# EAGLE design atmega8 (EAGLE 4.15)
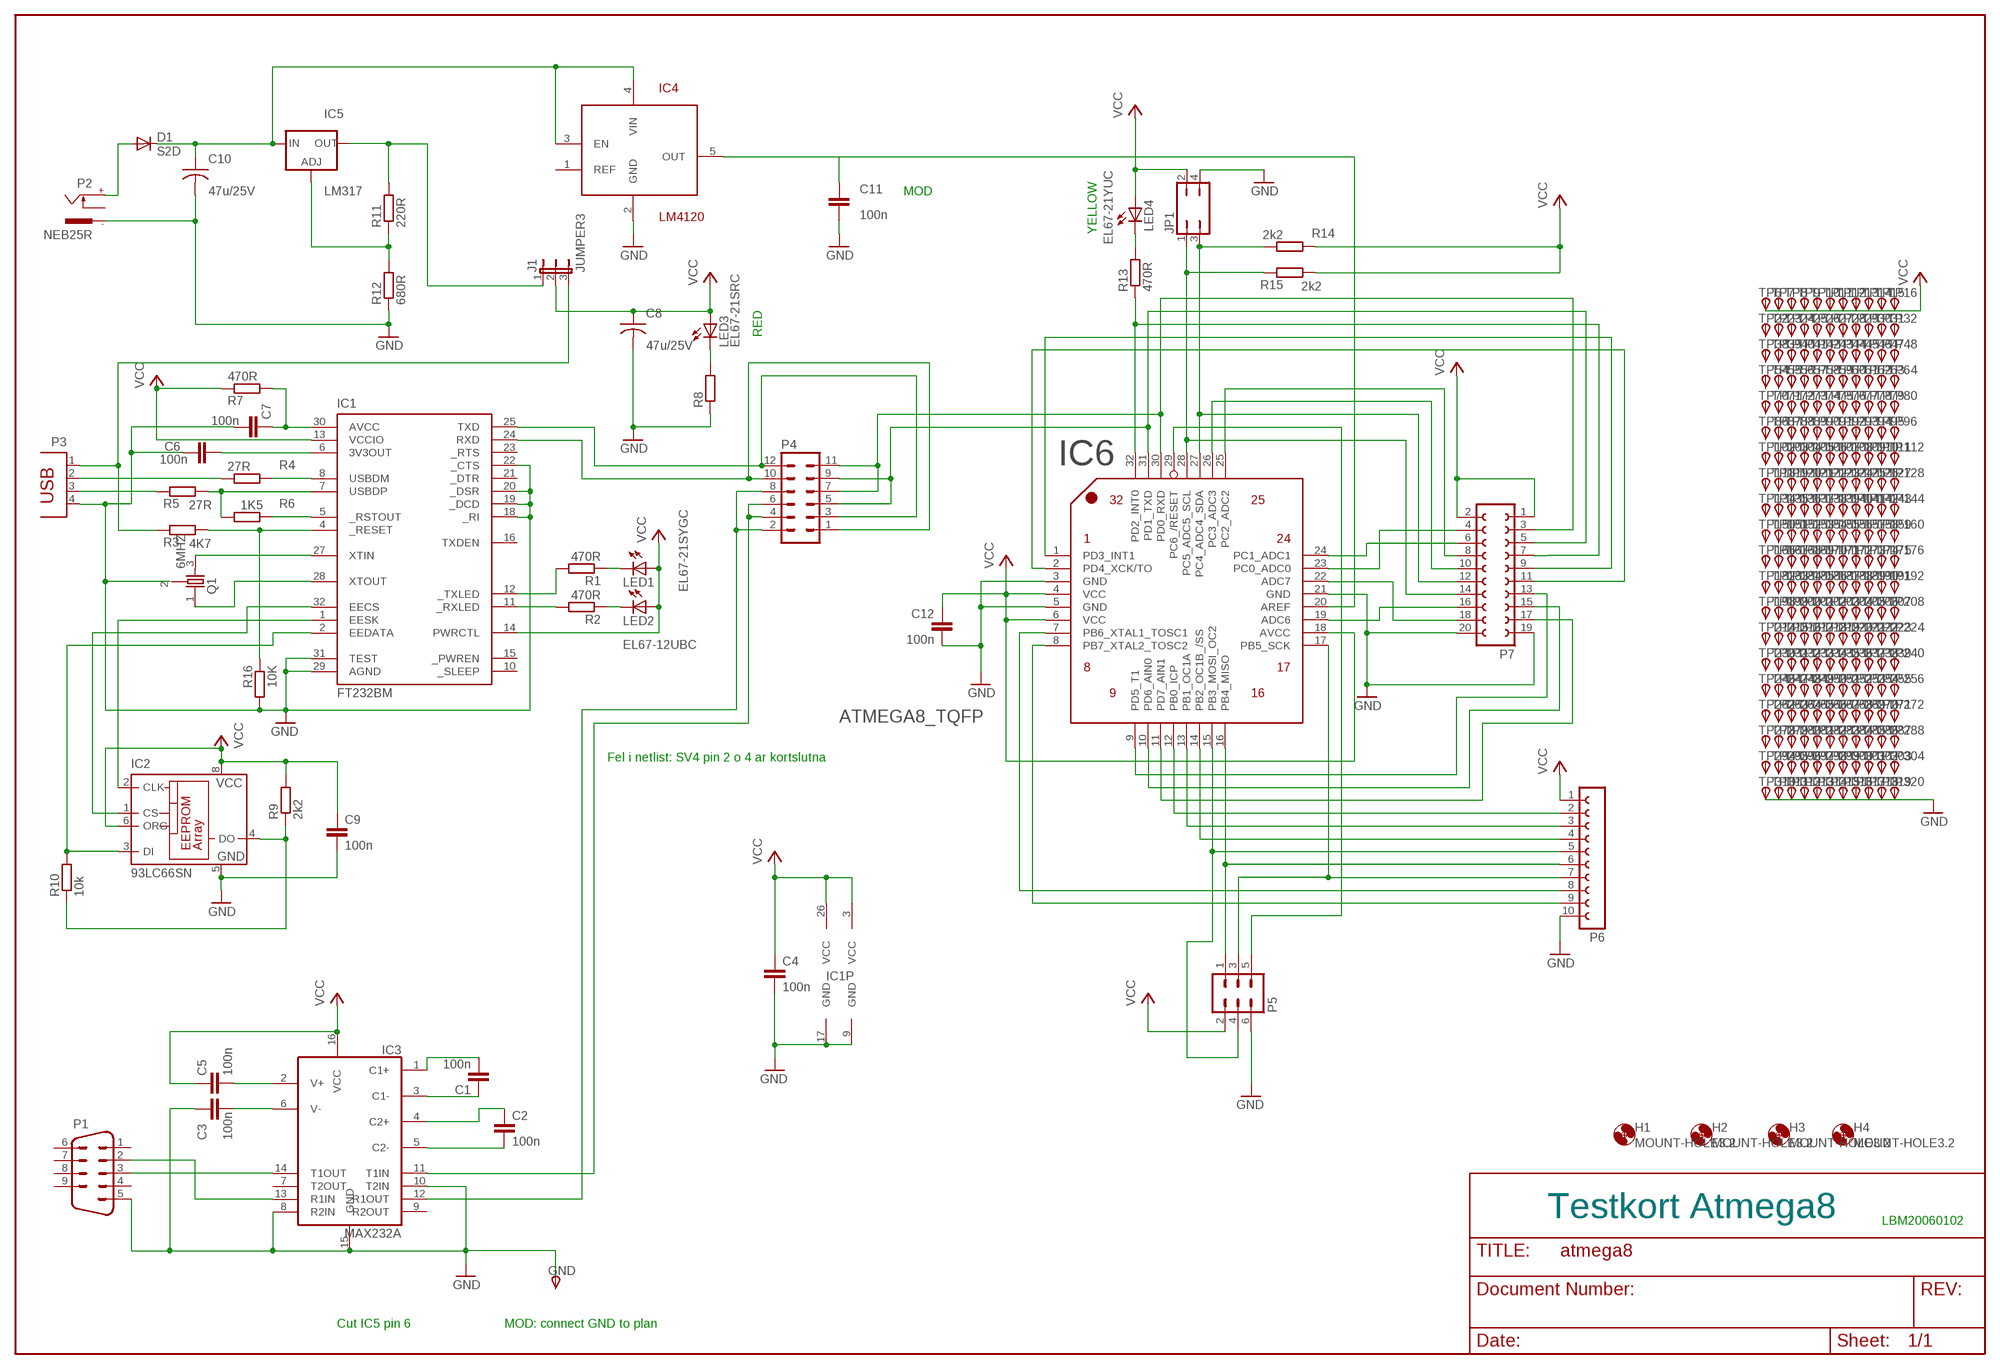
[diagram p0: schematic, sheet 1]

## Parts
C1  100n  C-EUC0805K  [C0805K]
C2  100n  C-EUC0805K  [C0805K]
C3  100n  C-EUC0805K  [C0805K]
C4  100n  C-EUC0805K  [C0805K]
C5  100n  C-EUC0805K  [C0805K]
C6  100n  C-EUC0805K  [C0805K]
C7  100n  C-EUC0805K  [C0805K]
C8  47u/25V  CAP2.5  [CAP2.5]
C9  100n  C-EUC0805K  [C0805K]
C10  47u/25V  CAP2.5  [CAP2.5]
C11  100n  C-EUC0805K  [C0805K]
C12  100n  C-EUC0805K  [C0805K]
D1  S2D  DIODE-SMB  [SMB]
GND  TPSPAD1-13  [P1-13]
H1  MOUNT-HOLE3.2  [3,2]
H2  MOUNT-HOLE3.2  [3,2]
H3  MOUNT-HOLE3.2  [3,2]
H4  MOUNT-HOLE3.2  [3,2]
IC1  FT232BM  [LQFP32]
IC2  93LC66SN  [SO-08]
IC3  MAX232A  [SO16]
IC4  LM4120  [SOT23-5]
IC5  LM317  LM317TS  [317TS]
IC6  ATMEGA8_TQFP  [TQFP-32]
J1  JUMPER3  [JUMPER3]
JP1  JP2Q  [JP2Q]
LED1  EL67-21SYGC  LEDSMT1206  [1206]
LED2  EL67-12UBC  LEDSMT1206  [1206]
LED3  EL67-21SRC  LEDSMT1206  [1206]
LED4  EL67-21YUC  LEDSMT1206  [1206]
P1  M09H  [M09H]
P2  NEB25R  [NEB25R]
P3  PN61729  [PN61729]
P4  MA06-2  [MA06-2]
P5  MA03-2  [MA03-2]
P6  FE10-1  [FE10]
P7  FE10-2  [FE10-2]
Q1  6MHZ  MURATA_RESONATOR  [MURATA_RESONATOR]
R1  470R  R-EU_R0805W  [R0805W]
R2  470R  R-EU_R0805W  [R0805W]
R3  4K7  R-EU_R0805W  [R0805W]
R4  27R  R-EU_R0805W  [R0805W]
R5  27R  R-EU_R0805W  [R0805W]
R6  1K5  R-EU_R0805W  [R0805W]
R7  470R  R-EU_R0805W  [R0805W]
R8  R-EU_R0805W  [R0805W]
R9  2k2  R-EU_R0805W  [R0805W]
R10  10k  R-EU_R0805W  [R0805W]
R11  220R  R-EU_R0805W  [R0805W]
R12  680R  R-EU_R0805W  [R0805W]
R13  470R  R-EU_R0805W  [R0805W]
R14  2k2  R-EU_R0805W  [R0805W]
R15  2k2  R-EU_R0805W  [R0805W]
R16  10K  R-EU_R0805W  [R0805W]
TP6  TPSPAD1-13  [P1-13]
TP7  TPSPAD1-13  [P1-13]
TP8  TPSPAD1-13  [P1-13]
TP9  TPSPAD1-13  [P1-13]
TP10  TPSPAD1-13  [P1-13]
TP11  TPSPAD1-13  [P1-13]
TP12  TPSPAD1-13  [P1-13]
TP13  TPSPAD1-13  [P1-13]
TP14  TPSPAD1-13  [P1-13]
TP15  TPSPAD1-13  [P1-13]
TP16  TPSPAD1-13  [P1-13]
TP22  TPSPAD1-13  [P1-13]
TP23  TPSPAD1-13  [P1-13]
TP24  TPSPAD1-13  [P1-13]
TP25  TPSPAD1-13  [P1-13]
TP26  TPSPAD1-13  [P1-13]
TP27  TPSPAD1-13  [P1-13]
TP28  TPSPAD1-13  [P1-13]
TP29  TPSPAD1-13  [P1-13]
TP30  TPSPAD1-13  [P1-13]
TP31  TPSPAD1-13  [P1-13]
TP32  TPSPAD1-13  [P1-13]
TP38  TPSPAD1-13  [P1-13]
TP39  TPSPAD1-13  [P1-13]
TP40  TPSPAD1-13  [P1-13]
TP41  TPSPAD1-13  [P1-13]
TP42  TPSPAD1-13  [P1-13]
TP43  TPSPAD1-13  [P1-13]
TP44  TPSPAD1-13  [P1-13]
TP45  TPSPAD1-13  [P1-13]
TP46  TPSPAD1-13  [P1-13]
TP47  TPSPAD1-13  [P1-13]
TP48  TPSPAD1-13  [P1-13]
TP54  TPSPAD1-13  [P1-13]
TP55  TPSPAD1-13  [P1-13]
TP56  TPSPAD1-13  [P1-13]
TP57  TPSPAD1-13  [P1-13]
TP58  TPSPAD1-13  [P1-13]
TP59  TPSPAD1-13  [P1-13]
TP60  TPSPAD1-13  [P1-13]
TP61  TPSPAD1-13  [P1-13]
TP62  TPSPAD1-13  [P1-13]
TP63  TPSPAD1-13  [P1-13]
TP64  TPSPAD1-13  [P1-13]
TP70  TPSPAD1-13  [P1-13]
TP71  TPSPAD1-13  [P1-13]
TP72  TPSPAD1-13  [P1-13]
TP73  TPSPAD1-13  [P1-13]
TP74  TPSPAD1-13  [P1-13]
TP75  TPSPAD1-13  [P1-13]
TP76  TPSPAD1-13  [P1-13]
TP77  TPSPAD1-13  [P1-13]
TP78  TPSPAD1-13  [P1-13]
TP79  TPSPAD1-13  [P1-13]
TP80  TPSPAD1-13  [P1-13]
TP86  TPSPAD1-13  [P1-13]
TP87  TPSPAD1-13  [P1-13]
TP88  TPSPAD1-13  [P1-13]
TP89  TPSPAD1-13  [P1-13]
TP90  TPSPAD1-13  [P1-13]
TP91  TPSPAD1-13  [P1-13]
TP92  TPSPAD1-13  [P1-13]
TP93  TPSPAD1-13  [P1-13]
TP94  TPSPAD1-13  [P1-13]
TP95  TPSPAD1-13  [P1-13]
TP96  TPSPAD1-13  [P1-13]
TP102  TPSPAD1-13  [P1-13]
TP103  TPSPAD1-13  [P1-13]
TP104  TPSPAD1-13  [P1-13]
TP105  TPSPAD1-13  [P1-13]
TP106  TPSPAD1-13  [P1-13]
TP107  TPSPAD1-13  [P1-13]
TP108  TPSPAD1-13  [P1-13]
TP109  TPSPAD1-13  [P1-13]
TP110  TPSPAD1-13  [P1-13]
TP111  TPSPAD1-13  [P1-13]
TP112  TPSPAD1-13  [P1-13]
TP118  TPSPAD1-13  [P1-13]
TP119  TPSPAD1-13  [P1-13]
TP120  TPSPAD1-13  [P1-13]
TP121  TPSPAD1-13  [P1-13]
TP122  TPSPAD1-13  [P1-13]
TP123  TPSPAD1-13  [P1-13]
TP124  TPSPAD1-13  [P1-13]
TP125  TPSPAD1-13  [P1-13]
TP126  TPSPAD1-13  [P1-13]
TP127  TPSPAD1-13  [P1-13]
TP128  TPSPAD1-13  [P1-13]
TP134  TPSPAD1-13  [P1-13]
TP135  TPSPAD1-13  [P1-13]
TP136  TPSPAD1-13  [P1-13]
TP137  TPSPAD1-13  [P1-13]
TP138  TPSPAD1-13  [P1-13]
TP139  TPSPAD1-13  [P1-13]
TP140  TPSPAD1-13  [P1-13]
TP141  TPSPAD1-13  [P1-13]
TP142  TPSPAD1-13  [P1-13]
TP143  TPSPAD1-13  [P1-13]
TP144  TPSPAD1-13  [P1-13]
TP150  TPSPAD1-13  [P1-13]
TP151  TPSPAD1-13  [P1-13]
TP152  TPSPAD1-13  [P1-13]
TP153  TPSPAD1-13  [P1-13]
TP154  TPSPAD1-13  [P1-13]
TP155  TPSPAD1-13  [P1-13]
TP156  TPSPAD1-13  [P1-13]
TP157  TPSPAD1-13  [P1-13]
TP158  TPSPAD1-13  [P1-13]
TP159  TPSPAD1-13  [P1-13]
TP160  TPSPAD1-13  [P1-13]
TP166  TPSPAD1-13  [P1-13]
TP167  TPSPAD1-13  [P1-13]
TP168  TPSPAD1-13  [P1-13]
TP169  TPSPAD1-13  [P1-13]
TP170  TPSPAD1-13  [P1-13]
TP171  TPSPAD1-13  [P1-13]
TP172  TPSPAD1-13  [P1-13]
TP173  TPSPAD1-13  [P1-13]
TP174  TPSPAD1-13  [P1-13]
TP175  TPSPAD1-13  [P1-13]
TP176  TPSPAD1-13  [P1-13]
TP182  TPSPAD1-13  [P1-13]
TP183  TPSPAD1-13  [P1-13]
TP184  TPSPAD1-13  [P1-13]
TP185  TPSPAD1-13  [P1-13]
TP186  TPSPAD1-13  [P1-13]
TP187  TPSPAD1-13  [P1-13]
TP188  TPSPAD1-13  [P1-13]
TP189  TPSPAD1-13  [P1-13]
TP190  TPSPAD1-13  [P1-13]
TP191  TPSPAD1-13  [P1-13]
TP192  TPSPAD1-13  [P1-13]
TP198  TPSPAD1-13  [P1-13]
TP199  TPSPAD1-13  [P1-13]
TP200  TPSPAD1-13  [P1-13]
TP201  TPSPAD1-13  [P1-13]
TP202  TPSPAD1-13  [P1-13]
TP203  TPSPAD1-13  [P1-13]
TP204  TPSPAD1-13  [P1-13]
TP205  TPSPAD1-13  [P1-13]
TP206  TPSPAD1-13  [P1-13]
TP207  TPSPAD1-13  [P1-13]
TP208  TPSPAD1-13  [P1-13]
TP214  TPSPAD1-13  [P1-13]
TP215  TPSPAD1-13  [P1-13]
TP216  TPSPAD1-13  [P1-13]
TP217  TPSPAD1-13  [P1-13]
TP218  TPSPAD1-13  [P1-13]
TP219  TPSPAD1-13  [P1-13]
TP220  TPSPAD1-13  [P1-13]
TP221  TPSPAD1-13  [P1-13]
TP222  TPSPAD1-13  [P1-13]
TP223  TPSPAD1-13  [P1-13]
TP224  TPSPAD1-13  [P1-13]
TP230  TPSPAD1-13  [P1-13]
TP231  TPSPAD1-13  [P1-13]
TP232  TPSPAD1-13  [P1-13]
TP233  TPSPAD1-13  [P1-13]
TP234  TPSPAD1-13  [P1-13]
TP235  TPSPAD1-13  [P1-13]
TP236  TPSPAD1-13  [P1-13]
TP237  TPSPAD1-13  [P1-13]
TP238  TPSPAD1-13  [P1-13]
TP239  TPSPAD1-13  [P1-13]
TP240  TPSPAD1-13  [P1-13]
TP246  TPSPAD1-13  [P1-13]
TP247  TPSPAD1-13  [P1-13]
TP248  TPSPAD1-13  [P1-13]
TP249  TPSPAD1-13  [P1-13]
TP250  TPSPAD1-13  [P1-13]
TP251  TPSPAD1-13  [P1-13]
TP252  TPSPAD1-13  [P1-13]
TP253  TPSPAD1-13  [P1-13]
TP254  TPSPAD1-13  [P1-13]
TP255  TPSPAD1-13  [P1-13]
TP256  TPSPAD1-13  [P1-13]
TP262  TPSPAD1-13  [P1-13]
TP263  TPSPAD1-13  [P1-13]
TP264  TPSPAD1-13  [P1-13]
TP265  TPSPAD1-13  [P1-13]
TP266  TPSPAD1-13  [P1-13]
TP267  TPSPAD1-13  [P1-13]
TP268  TPSPAD1-13  [P1-13]
TP269  TPSPAD1-13  [P1-13]
TP270  TPSPAD1-13  [P1-13]
TP271  TPSPAD1-13  [P1-13]
TP272  TPSPAD1-13  [P1-13]
TP278  TPSPAD1-13  [P1-13]
TP279  TPSPAD1-13  [P1-13]
TP280  TPSPAD1-13  [P1-13]
TP281  TPSPAD1-13  [P1-13]
TP282  TPSPAD1-13  [P1-13]
TP283  TPSPAD1-13  [P1-13]
TP284  TPSPAD1-13  [P1-13]
TP285  TPSPAD1-13  [P1-13]
TP286  TPSPAD1-13  [P1-13]
TP287  TPSPAD1-13  [P1-13]
TP288  TPSPAD1-13  [P1-13]
TP294  TPSPAD1-13  [P1-13]
TP295  TPSPAD1-13  [P1-13]
TP296  TPSPAD1-13  [P1-13]
TP297  TPSPAD1-13  [P1-13]
TP298  TPSPAD1-13  [P1-13]
TP299  TPSPAD1-13  [P1-13]
TP300  TPSPAD1-13  [P1-13]
TP301  TPSPAD1-13  [P1-13]
TP302  TPSPAD1-13  [P1-13]
TP303  TPSPAD1-13  [P1-13]
TP304  TPSPAD1-13  [P1-13]
TP310  TPSPAD1-13  [P1-13]
TP311  TPSPAD1-13  [P1-13]
TP312  TPSPAD1-13  [P1-13]
TP313  TPSPAD1-13  [P1-13]
TP314  TPSPAD1-13  [P1-13]
TP315  TPSPAD1-13  [P1-13]
TP316  TPSPAD1-13  [P1-13]
TP317  TPSPAD1-13  [P1-13]
TP318  TPSPAD1-13  [P1-13]
TP319  TPSPAD1-13  [P1-13]
TP320  TPSPAD1-13  [P1-13]

## Nets
GND [power]: C3.1 C4.2 C6.2 C7.2 C8.2 C9.2 C10.2 C11.2 C12.2 IC1.9(GND) IC1.17(GND) IC1.18(_RI) IC1.19(_DCD) IC1.20(_DSR) IC1.22(_CTS) IC1.29(AGND) IC1.31(TEST) IC2.5(GND) IC3.8(R2IN) IC3.10(T2IN) IC3.15(GND) IC4.2(GND) IC6.3(GND) IC6.5(GND) IC6.21(GND) JP1.4 P1.5 P2.- P3.4 P5.6 P6.10 P7.19 P7.20 Q1.2 R8.1 R12.1 R16.2 TP310.1(PP) TP311.1(PP) TP312.1(PP) TP313.1(PP) TP314.1(PP) TP315.1(PP) TP316.1(PP) TP317.1(PP) TP318.1(PP) TP319.1(PP) TP320.1(PP)
N$1 [power]: IC5.2(OUT) J1.1 R11.2
N$2 [power]: C10.1 D1.C IC4.3(EN) IC4.4(VIN) IC5.3(IN)
N$3 [power]: D1.A P2.+
N$4: IC5.1(ADJ) R11.1 R12.2
N$5: IC1.8(USBDM) R4.2
N$6: IC1.27(XTIN) Q1.3
N$7: P3.2 R4.1
N$8: P3.3 R5.1
N$9: IC1.7(USBDP) R5.2 R6.1
N$10: IC1.28(XTOUT) Q1.1
N$11 [power]: J1.3 P3.1 R3.1
N$12: IC1.4(_RESET) R3.2 R16.1
N$13: IC1.5(_RSTOUT) R6.2
N$14: LED3.C R8.2
N$15: C5.2 IC3.2(V+)
N$16: C7.1 IC1.30(AVCC) R7.2
N$17: C6.1 IC1.6(3V3OUT)
N$18: C3.2 IC3.6(V-)
N$19: IC6.16(PB4_MISO) P5.1 P6.6
N$20: C1.1 IC3.3(C1-)
N$21: C1.2 IC3.1(C1+)
N$22: C2.1 IC3.4(C2+)
N$23: C2.2 IC3.5(C2-)
N$24: IC6.15(PB3_MOSI_OC2) P5.4 P6.5
N$25: IC6.17(PB5_SCK) P5.3 P6.7
N$26: IC6.29(PC6_/RESET) P5.5
N$27: IC6.30(PD0_RXD) P4.7 P4.11 P7.3
N$28: IC6.31(PD1_TXD) P4.5 P4.9 P7.5
N$29: IC6.32(PD2_INT0) P7.7 R13.1
N$30: IC6.1(PD3_INT1) P7.9
N$31: IC6.2(PD4_XCK/TO) P7.11
N$32: IC6.28(PC5_ADC5_SCL) JP1.1 P7.14 R15.2
N$33: IC6.27(PC4_ADC4_SDA) JP1.3 P7.12 R14.2
N$34: IC6.26(PC3_ADC3) P7.10
N$35: IC6.25(PC2_ADC2) P7.8
N$36: IC6.24(PC1_ADC1) P7.6
N$37: IC6.23(PC0_ADC0) P7.4
N$38: IC6.22(ADC7) P7.18
N$39: IC6.19(ADC6) P7.16
N$40: IC2.4(DO) R9.1 R10.1
N$41: IC6.14(PB2_OC1B_/SS) P6.4
N$42: IC6.13(PB1_OC1A) P6.3
N$43: IC6.12(PB0_ICP) P6.2
N$44: IC6.11(PD7_AIN1) P7.17
N$45: IC6.10(PD6_AIN0) P7.15
N$46: IC6.9(PD5_T1) P7.13
N$47: IC6.7(PB6_XTAL1_TOSC1) P6.8
N$48: IC6.8(PB7_XTAL2_TOSC2) P6.9
N$49: C11.1 IC4.5(OUT) IC6.20(AREF)
N$50: LED4.C R13.2
N$51: IC1.25(TXD) P4.3 P4.12
N$52: IC1.24(RXD) P4.1 P4.10
N$53: LED1.C R1.1
N$54: LED2.C R2.1
N$55: IC1.11(_RXLED) R2.2
N$56: IC1.12(_TXLED) R1.2
N$57: IC1.1(EESK) IC2.2(CLK)
N$58: IC1.32(EECS) IC2.1(CS)
N$59: IC1.2(EEDATA) IC2.3(DI) R10.2
N$60: IC3.14(T1OUT) P1.3
N$61: IC3.13(R1IN) P1.2
N$62: IC3.11(T1IN) IC3.12(R1OUT) P4.2 P4.4 P4.6 P4.8
VCC [power]: C4.1 C5.1 C8.1 C9.1 C12.1 IC1.3(VCC) IC1.13(VCCIO) IC1.14(PWRCTL) IC1.26(VCC) IC2.6(ORG) IC2.8(VCC) IC3.16(VCC) IC6.4(VCC) IC6.6(VCC) IC6.18(AVCC) J1.2 JP1.2 LED1.A LED2.A LED3.A LED4.A P5.2 P6.1 P7.1 P7.2 R7.1 R9.2 R14.1 R15.1 TP6.1(PP) TP7.1(PP) TP8.1(PP) TP9.1(PP) TP10.1(PP) TP11.1(PP) TP12.1(PP) TP13.1(PP) TP14.1(PP) TP15.1(PP) TP16.1(PP)
Unconnected: GND.1(PP) IC1.10(_SLEEP) IC1.15(_PWREN) IC1.16(TXDEN) IC1.21(_DTR) IC1.23(_RTS) IC2.7(NU) IC3.7(T2OUT) IC3.9(R2OUT) IC4.1(REF) P1.1 P1.4 P1.6 P1.7 P1.8 P1.9 P2.C TP22.1(PP) TP23.1(PP) TP24.1(PP) TP25.1(PP) TP26.1(PP) TP27.1(PP) TP28.1(PP) TP29.1(PP) TP30.1(PP) TP31.1(PP) TP32.1(PP) TP38.1(PP) TP39.1(PP) TP40.1(PP) TP41.1(PP) TP42.1(PP) TP43.1(PP) TP44.1(PP) TP45.1(PP) TP46.1(PP) TP47.1(PP) TP48.1(PP) TP54.1(PP) TP55.1(PP) TP56.1(PP) TP57.1(PP) TP58.1(PP) TP59.1(PP) TP60.1(PP) TP61.1(PP) TP62.1(PP) TP63.1(PP) TP64.1(PP) TP70.1(PP) TP71.1(PP) TP72.1(PP) TP73.1(PP) TP74.1(PP) TP75.1(PP) TP76.1(PP) TP77.1(PP) TP78.1(PP) TP79.1(PP) TP80.1(PP) TP86.1(PP) TP87.1(PP) TP88.1(PP) TP89.1(PP) TP90.1(PP) TP91.1(PP) TP92.1(PP) TP93.1(PP) TP94.1(PP) TP95.1(PP) TP96.1(PP) TP102.1(PP) TP103.1(PP) TP104.1(PP) TP105.1(PP) TP106.1(PP) TP107.1(PP) TP108.1(PP) TP109.1(PP) TP110.1(PP) TP111.1(PP) TP112.1(PP) TP118.1(PP) TP119.1(PP) TP120.1(PP) TP121.1(PP) TP122.1(PP) TP123.1(PP) TP124.1(PP) TP125.1(PP) TP126.1(PP) TP127.1(PP) TP128.1(PP) TP134.1(PP) TP135.1(PP) TP136.1(PP) TP137.1(PP) TP138.1(PP) TP139.1(PP) TP140.1(PP) TP141.1(PP) TP142.1(PP) TP143.1(PP) TP144.1(PP) TP150.1(PP) TP151.1(PP) TP152.1(PP) TP153.1(PP) TP154.1(PP) TP155.1(PP) TP156.1(PP) TP157.1(PP) TP158.1(PP) TP159.1(PP) TP160.1(PP) TP166.1(PP) TP167.1(PP) TP168.1(PP) TP169.1(PP) TP170.1(PP) TP171.1(PP) TP172.1(PP) TP173.1(PP) TP174.1(PP) TP175.1(PP) TP176.1(PP) TP182.1(PP) TP183.1(PP) TP184.1(PP) TP185.1(PP) TP186.1(PP) TP187.1(PP) TP188.1(PP) TP189.1(PP) TP190.1(PP) TP191.1(PP) TP192.1(PP) TP198.1(PP) TP199.1(PP) TP200.1(PP) TP201.1(PP) TP202.1(PP) TP203.1(PP) TP204.1(PP) TP205.1(PP) TP206.1(PP) TP207.1(PP) TP208.1(PP) TP214.1(PP) TP215.1(PP) TP216.1(PP) TP217.1(PP) TP218.1(PP) TP219.1(PP) TP220.1(PP) TP221.1(PP) TP222.1(PP) TP223.1(PP) TP224.1(PP) TP230.1(PP) TP231.1(PP) TP232.1(PP) TP233.1(PP) TP234.1(PP) TP235.1(PP) TP236.1(PP) TP237.1(PP) TP238.1(PP) TP239.1(PP) TP240.1(PP) TP246.1(PP) TP247.1(PP) TP248.1(PP) TP249.1(PP) TP250.1(PP) TP251.1(PP) TP252.1(PP) TP253.1(PP) TP254.1(PP) TP255.1(PP) TP256.1(PP) TP262.1(PP) TP263.1(PP) TP264.1(PP) TP265.1(PP) TP266.1(PP) TP267.1(PP) TP268.1(PP) TP269.1(PP) TP270.1(PP) TP271.1(PP) TP272.1(PP) TP278.1(PP) TP279.1(PP) TP280.1(PP) TP281.1(PP) TP282.1(PP) TP283.1(PP) TP284.1(PP) TP285.1(PP) TP286.1(PP) TP287.1(PP) TP288.1(PP) TP294.1(PP) TP295.1(PP) TP296.1(PP) TP297.1(PP) TP298.1(PP) TP299.1(PP) TP300.1(PP) TP301.1(PP) TP302.1(PP) TP303.1(PP) TP304.1(PP)

## Notes on the sheet
- MOD
- YELLOW
- RED
- Fel i netlist: SV4 pin 2 o 4 ar kortslutna
- Testkort Atmega8
- LBM20060102
- Cut IC5 pin 6 | MOD: connect GND to plan

## Library data of the parts
C1-C7 C9 C11 C12 = rcl:C-EU: CAPACITOR, European symbol
C8 C10 = lbm:CAP2.5
D1 = diode:DIODE-: DIODE
GND TP6-TP16 TP22-TP32 TP38-TP48 TP54-TP64 TP70-TP80 TP86-TP96 TP102-TP112 TP118-TP128 TP134-TP144 TP150-TP160 TP166-TP176 TP182-TP192 TP198-TP208 TP214-TP224 TP230-TP240 TP246-TP256 TP262-TP272 TP278-TP288 TP294-TP304 TP310-TP320 = testpad:TPS: TEST PIN
H1-H4 = holes:MOUNT-HOLE: MOUNTING HOLE with drill center marker
IC1 = ftdi3:FT232BM: USB UART 2nd Generation USB UART (USB <-> Serial)
IC2 = microchip:93*: Serial EPROM 1 K/2 K/4 K, low voltage, Microwire
IC3 = lbm:MAX232A
IC4 = lbm:LM4120
IC5 = v-reg:LM317TS: VOLTAGE REGULATOR
IC6 = atmel_prototype_header:ATMEGA8: IC AVR MCU 8K LV 8MHZ IND 32TQFP , Atmel Part number ATMEGA8L-8AI
J1 = lbm:JUMPER3
JP1 = jumper:JP2Q: JUMPER
LED1-LED4 = led:LED: LED OSRAM: - CHIPLED LG R971, LG N971, LY N971, LG Q971, LY Q971, LO R971, LY R971 LH N974, LH R974 LS Q976, LO Q976, LY Q976 LO Q996 - Hyper CHIPLED LW Q18S LB Q993, LB Q99A, LB R99A - SideLED LS A670, LO A670, LY A670, LG A670, LP A670 LB A673, LV A673, LT A673, LW A673 LH A674 LY A675 LS A676, LA A676, LO A676, LY A676, LW A676 LS A679, LY A679, LG A679 - Hyper Micro SIDELED® LS Y876, LA Y876, LO Y876, LY Y876 LT Y87S - SmartLED LW L88C, LW L88S LB L89C, LB L89S, LG L890 LS L89K, LO L89K, LY L89K LS L896, LA L896, LO L896, LY L896 - TOPLED LS T670, LO T670, LY T670, LG T670, LP T670 LSG T670, LSP T670, LSY T670, LOP T670, LYG T670 LG T671, LOG T671, LSG T671 LB T673, LV T673, LT T673, LW T673 LH T674 LS T676, LA T676, LO T676, LY T676, LB T676, LH T676, LSB T676, LW T676 LB T67C, LV T67C, LT T67C, LS T67K, LO T67K, LY T67K, LW E67C LS E67B, LA E67B, LO E67B, LY E67B, LB E67C, LV E67C, LT E67C LW T67C LS T679, LY T679, LG T679 LS T770, LO T770, LY T770, LG T770, LP T770 LB T773, LV T773, LT T773, LW T773 LH T774 LS E675, LA E675, LY E675, LS T675 LS T776, LA T776, LO T776, LY T776, LB T776 LHGB T686 LT T68C, LB T68C - Hyper Mini TOPLED® LB M676 - Mini TOPLED Santana® LG M470 LS M47K, LO M47K, LY M47K Source: http://www.osram.convergy.de/
P1 = con-subd:M09: SUB-D
P2 = con-lumberg:NEB25R: Klinkeneinbaukupplung
P3 = con-berg:PN61729: BERG USB connector
P4 = con-lstb:MA06-2: PIN HEADER
P5 = con-lstb:MA03-2: PIN HEADER
P6 = con-lsta:FE10-1: FEMALE HEADER
P7 = con-lsta:FE10-2: FEMALE HEADER
Q1 = lbm:MURATA_RESONATOR
R1-R16 = rcl:R-EU_: RESISTOR, European symbol

## Net classes
1 power: width 0.813 mm, drill 0.203 mm

## Board
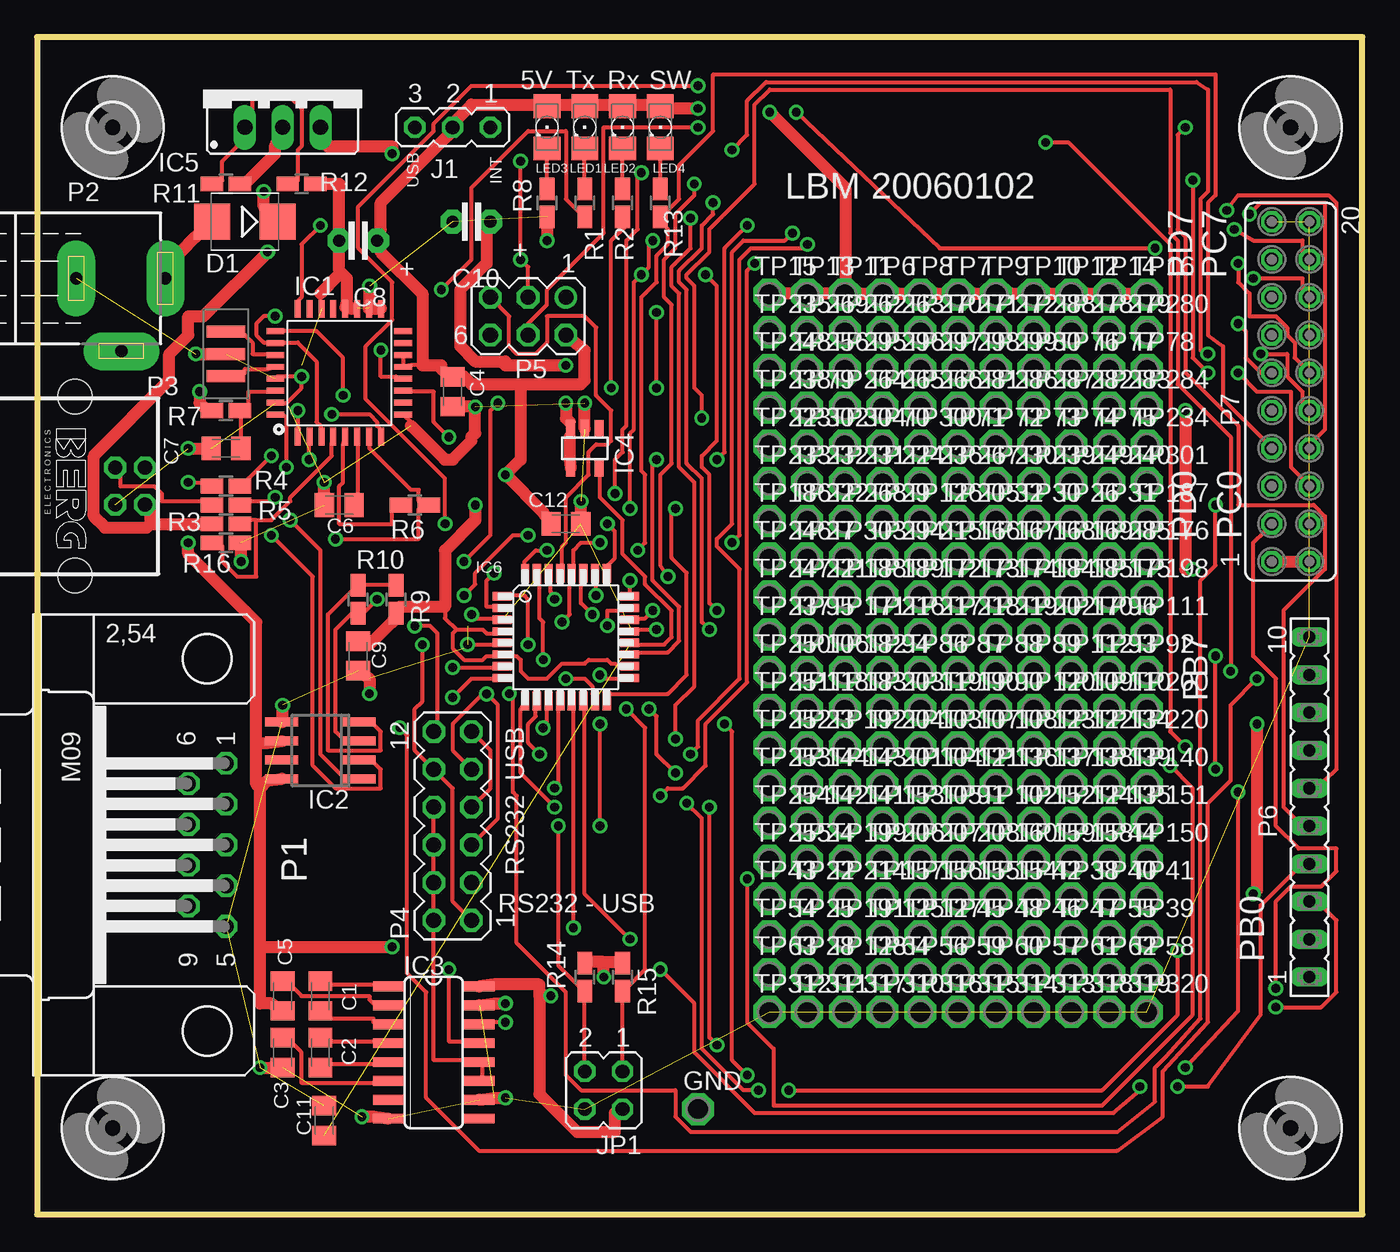
[diagram p1: board, top side]
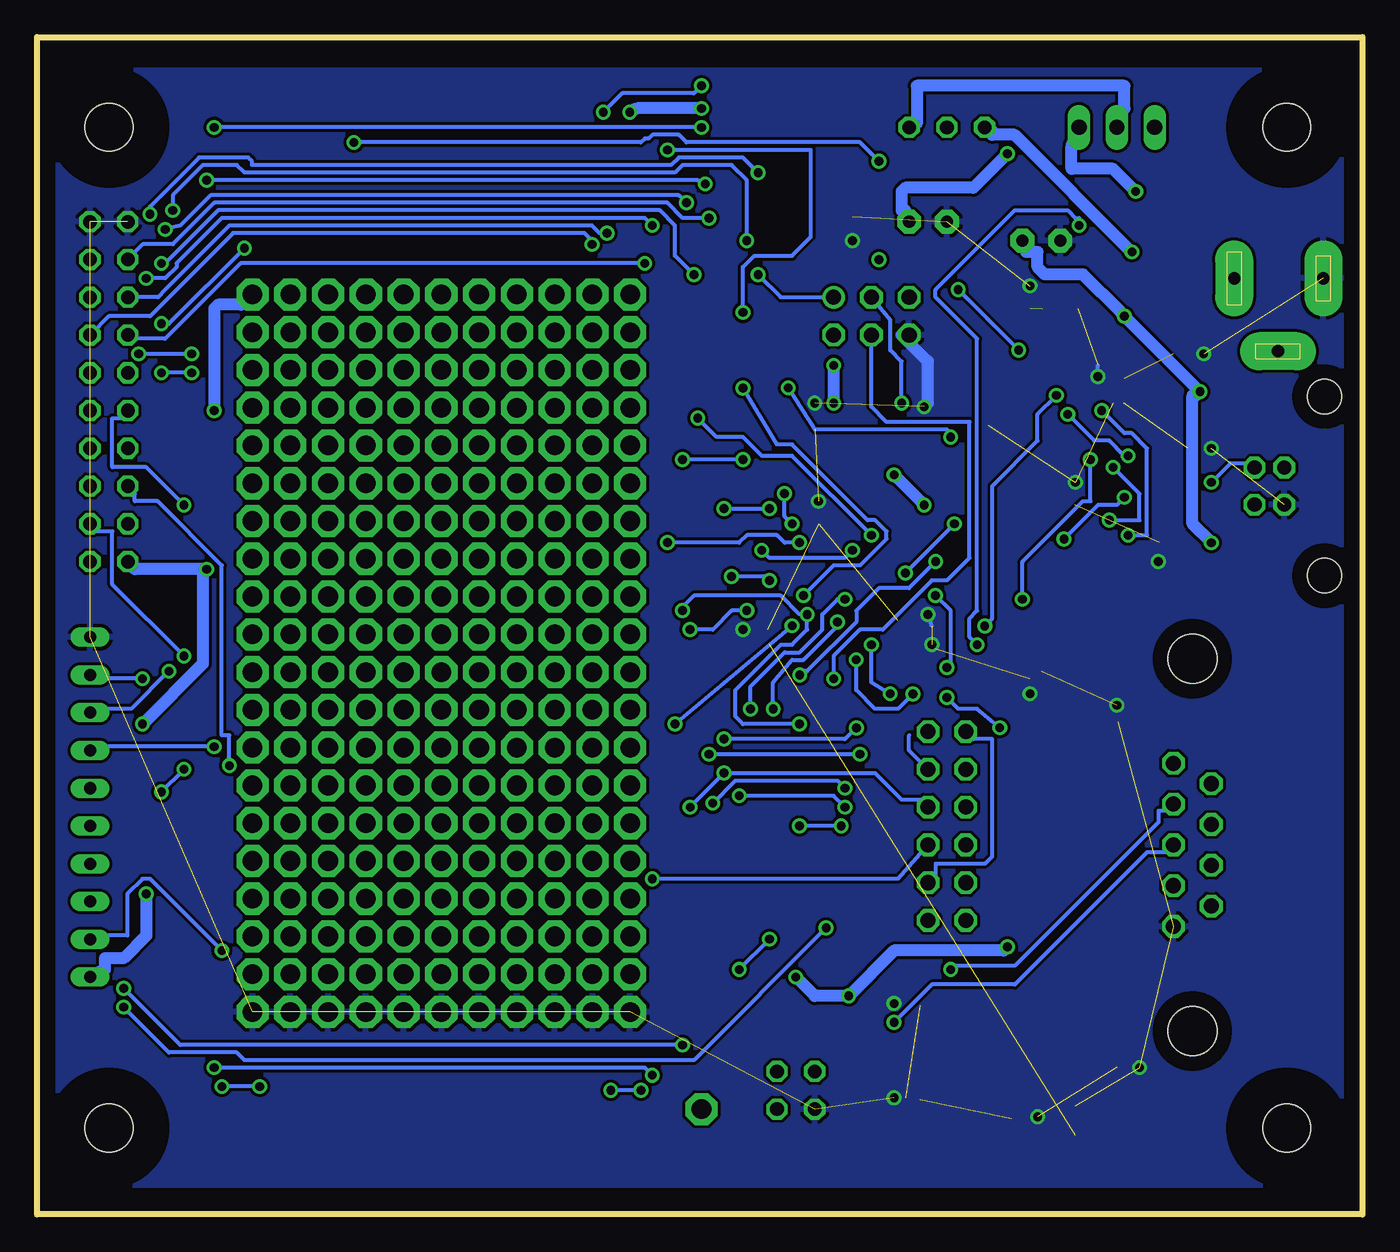
[diagram p2: board, bottom side, seen from below]

Size 89.13 x 79.18 mm. Coordinates in mm from the lower left corner, seen from the top.
Outline: 0,0 89.13,0 89.13,79.18 0,79.18 0,0
Copper layers (1*16): Top 0.035mm / dielectric 1.5mm / Bottom 0.035mm
Design rules "default": minimum track width 10mil, minimum drill 23mil, track to track 8mil, track to pad 8mil, pad to pad 8mil, via to via 8mil, smd to smd 8mil, copper to edge 40mil, drill to drill 8mil, minimum pad ring 10mil, minimum via ring 8mil, stop-mask expansion 4mil, vias tented up to drill 0mil, thermal gap 10mil
tKeepout: area 0,76.9 to 88.9,79.5; area 0,-0.5 to 88.9,2
bKeepout: area 0,76.9 to 88.9,79.5; area 0,-0.5 to 88.9,2

### Footprints (pad centres in the part's own frame; a part is rotated, then mirrored left to right if it is on the bottom)
C0805K = smd 1.3 x 1.6: 1 -1,0; 2 1,0
CAP2.5 = drill 0.813 pad 1.6 octagon: 1 -2.54,0; 2 0,0
SMB = smd 2.4 x 2.4: A 2.2,0; C -2.2,0
P1-13 = drill 1.321 pad 2.159 octagon: 1 0,0
3,2 = hole 3.2: 0,0
LQFP32 = smd 0.4 x 1.2: 1 -2.8,-4.3; 2 -2,-4.3; 3 -1.2,-4.3; 4 -0.4,-4.3; 5 0.4,-4.3; 6 1.2,-4.3; 7 2,-4.3; 8 2.8,-4.3; 17 2.8,4.3; 18 2,4.3; 19 1.2,4.3; 20 0.4,4.3; 21 -0.4,4.3; 22 -1.2,4.3; 23 -2,4.3; 24 -2.8,4.3 | smd 1.2 x 0.4: 9 4.3,-2.8; 10 4.3,-2; 11 4.3,-1.2; 12 4.3,-0.4; 13 4.3,0.4; 14 4.3,1.2; 15 4.3,2; 16 4.3,2.8; 25 -4.3,2.8; 26 -4.3,2; 27 -4.3,1.2; 28 -4.3,0.4; 29 -4.3,-0.4; 30 -4.3,-1.2; 31 -4.3,-2; 32 -4.3,-2.8
SO-08 = smd 0.6 x 2.2: 1 -1.905,-2.6; 2 -0.635,-2.6; 3 0.635,-2.6; 4 1.905,-2.6; 5 1.905,2.6; 6 0.635,2.6; 7 -0.635,2.6; 8 -1.905,2.6
SO16 = smd 0.66 x 2.032: 1 -4.445,-3.073; 2 -3.175,-3.073; 3 -1.905,-3.073; 4 -0.635,-3.073; 5 0.635,-3.073; 6 1.905,-3.073; 7 3.175,-3.073; 8 4.445,-3.073; 9 4.445,3.073; 10 3.175,3.073; 11 1.905,3.073; 12 0.635,3.073; 13 -0.635,3.073; 14 -1.905,3.073; 15 -3.175,3.073; 16 -4.445,3.073
SOT23-5 = smd 0.6 x 1.2: 1 -0.95,-1.306; 2 0,-1.306; 3 0.95,-1.306; 4 0.95,1.306; 5 -0.95,1.306
317TS = drill 1.016 long: 1 -2.54,-2.54; 2 0,-2.54; 3 2.54,-2.54
TQFP-32 = smd 1.27 x 0.559: 1 -4.293,2.743; 2 -4.293,1.956; 3 -4.293,1.168; 4 -4.293,0.381; 5 -4.293,-0.381; 6 -4.293,-1.168; 7 -4.293,-1.956; 8 -4.293,-2.743; 17 4.293,-2.743; 18 4.293,-1.956; 19 4.293,-1.168; 20 4.293,-0.381; 21 4.293,0.381; 22 4.293,1.168; 23 4.293,1.956; 24 4.293,2.743 | smd 0.559 x 1.27: 9 -2.743,-4.293; 10 -1.956,-4.293; 11 -1.168,-4.293; 12 -0.381,-4.293; 13 0.381,-4.293; 14 1.168,-4.293; 15 1.956,-4.293; 16 2.743,-4.293; 25 2.743,4.293; 26 1.956,4.293; 27 1.168,4.293; 28 0.381,4.293; 29 -0.381,4.293; 30 -1.168,4.293; 31 -1.956,4.293; 32 -2.743,4.293
JUMPER3 = drill 0.914 octagon: 1 -2.54,-1.27; 2 0,-1.27; 3 2.54,-1.27
JP2Q = drill 0.914 octagon: 1 -1.27,-1.27; 2 -1.27,1.27; 3 1.27,-1.27; 4 1.27,1.27
1206 = smd 1.6 x 1.803: A -1.422,0; C 1.422,0
M09H = drill 1.016 octagon: 1 -5.486,1.27; 2 -2.743,1.27; 3 0,1.27; 4 2.743,1.27; 5 5.486,1.27; 6 -4.115,-1.27; 7 -1.372,-1.27; 8 1.372,-1.27; 9 4.115,-1.27 | hole 3.302: 12.522,0; -12.522,0
NEB25R = drill 0.813 pad 2.54 long: + 0,7.35; - 0,1.35; C 4.9,4.4
PN61729 = drill 0.95 octagon: 1 1.25,4.71; 2 -1.25,4.71; 3 -1.25,2.71; 4 1.25,2.71 | hole 2.3: -6.02,0; 6.02,0
MA06-2 = drill 1.016 octagon: 1 -6.35,-1.27; 2 -6.35,1.27; 3 -3.81,-1.27; 4 -3.81,1.27; 5 -1.27,-1.27; 6 -1.27,1.27; 7 1.27,-1.27; 8 1.27,1.27; 9 3.81,-1.27; 10 3.81,1.27; 11 6.35,-1.27; 12 6.35,1.27
MA03-2 = drill 1.016 round: 1 -2.54,-1.27 | drill 1.016 octagon: 2 -2.54,1.27; 3 0,-1.27; 4 0,1.27; 5 2.54,-1.27; 6 2.54,1.27
FE10 = drill 0.813 long: 1 -11.43,0; 2 -8.89,0; 3 -6.35,0; 4 -3.81,0; 5 -1.27,0; 6 1.27,0; 7 3.81,0; 8 6.35,0; 9 8.89,0; 10 11.43,0
FE10-2 = drill 0.914 octagon: 1 -11.43,1.27; 2 -11.43,-1.27; 3 -8.89,1.27; 4 -8.89,-1.27; 5 -6.35,1.27; 6 -6.35,-1.27; 7 -3.81,1.27; 8 -3.81,-1.27; 9 -1.27,1.27; 10 -1.27,-1.27; 11 1.27,1.27; 12 1.27,-1.27; 13 3.81,1.27; 14 3.81,-1.27; 15 6.35,1.27; 16 6.35,-1.27; 17 8.89,1.27; 18 8.89,-1.27; 19 11.43,1.27; 20 11.43,-1.27
MURATA_RESONATOR = smd 0.8 x 2.6: 1 -1.5,0; 2 0,0; 3 1.5,0
R0805W = smd 1.5 x 1: 1 -0.94,0; 2 0.94,0

### Placement (x,y rotation side)
C1  19.05,14.7 90 top
C2  19.05,10.89 270 top
C3  16.51,10.89 90 top
C4  27.94,55.34 270 top
C5  16.51,14.7 90 top
C6  20.32,47.72 180 top
C7  12.7,51.53 180 top
C8  20.32,65.5 180 top
C9  21.59,37.56 270 top
C10  27.94,66.77 180 top
C11  19.3,6.32 90 top
C12  35.56,46.45 0 top
D1  13.97,66.77 180 top
GND  44.45,7.08 0 top
H1  5.08,73.12 0 top
H2  5.08,5.81 0 top
H3  84.3,73.12 0 top
H4  84.3,5.81 0 top
IC1  20.32,56.61 0 top
IC2  19.05,31.21 90 top
IC3  26.67,10.89 270 top
IC4  36.83,51.53 180 top
IC5  16.51,75.66 0 top
IC6  35.56,38.83 0 top
J1  27.94,71.85 180 top
JP1  38.1,8.35 180 top
LED1  36.83,73.12 270 top
LED2  39.37,73.12 270 top
LED3  34.29,73.12 270 top
LED4  41.91,73.12 270 top
P1  11.43,24.86 270 top
P2  1.27,62.96 270 top
P3  2.54,48.99 270 top
P4  27.94,26.13 90 top
P5  33.02,60.42 180 top
P6  85.57,27.4 90 top
P7  84.3,55.34 90 top
Q1  12.7,57.88 90 top
R1  36.83,68.04 270 top
R2  39.37,68.04 270 top
R3  12.7,46.45 0 top
R4  12.7,48.99 0 top
R5  12.7,47.72 0 top
R6  25.4,47.72 180 top
R7  12.7,54.07 0 top
R8  34.29,68.04 90 top
R9  24.13,41.37 270 top
R10  21.59,41.37 270 top
R11  12.7,69.31 0 top
R12  17.78,69.31 180 top
R13  41.91,68.04 90 top
R14  36.83,15.97 270 top
R15  39.37,15.97 270 top
R16  12.7,45.18 0 top
TP6  56.86,61.88 0 top
TP7  61.94,61.88 0 top
TP8  59.4,61.88 0 top
TP9  64.48,61.88 0 top
TP10  67.02,61.88 0 top
TP11  54.32,61.88 0 top
TP12  69.56,61.88 0 top
TP13  51.78,61.88 0 top
TP14  72.1,61.88 0 top
TP15  49.24,61.88 0 top
TP16  74.64,61.88 0 top
TP22  51.78,21.24 0 top
TP23  51.78,31.4 0 top
TP24  51.78,23.78 0 top
TP25  51.78,18.7 0 top
TP26  69.56,46.64 0 top
TP27  51.78,44.1 0 top
TP28  51.78,16.16 0 top
TP29  56.86,46.64 0 top
TP30  67.02,46.64 0 top
TP31  72.1,46.64 0 top
TP32  64.48,46.64 0 top
TP38  69.56,21.24 0 top
TP39  74.64,18.7 0 top
TP40  72.1,21.24 0 top
TP41  74.64,21.24 0 top
TP42  67.02,21.24 0 top
TP43  49.24,21.24 0 top
TP44  72.1,23.78 0 top
TP45  61.94,18.7 0 top
TP46  67.02,18.7 0 top
TP47  69.56,18.7 0 top
TP48  64.48,18.7 0 top
TP54  49.24,18.7 0 top
TP55  72.1,18.7 0 top
TP56  59.4,16.16 0 top
TP57  67.02,16.16 0 top
TP58  74.64,16.16 0 top
TP59  61.94,16.16 0 top
TP60  64.48,16.16 0 top
TP61  69.56,16.16 0 top
TP62  72.1,16.16 0 top
TP63  49.24,16.16 0 top
TP64  56.86,16.16 0 top
TP70  56.86,51.72 0 top
TP71  61.94,51.72 0 top
TP72  64.48,51.72 0 top
TP73  67.02,51.72 0 top
TP74  69.56,51.72 0 top
TP75  72.1,51.72 0 top
TP76  69.56,56.8 0 top
TP77  72.1,56.8 0 top
TP78  74.64,56.8 0 top
TP79  51.78,54.26 0 top
TP80  67.02,56.8 0 top
TP86  59.4,36.48 0 top
TP87  61.94,36.48 0 top
TP88  64.48,36.48 0 top
TP89  67.02,36.48 0 top
TP90  64.48,33.94 0 top
TP91  61.94,26.32 0 top
TP92  74.64,36.48 0 top
TP93  72.1,36.48 0 top
TP94  56.86,36.48 0 top
TP95  51.78,39.02 0 top
TP96  72.1,39.02 0 top
TP102  64.48,26.32 0 top
TP103  59.4,31.4 0 top
TP104  59.4,28.86 0 top
TP105  59.4,26.32 0 top
TP106  51.78,36.48 0 top
TP107  61.94,31.4 0 top
TP108  64.48,31.4 0 top
TP109  69.56,33.94 0 top
TP110  72.1,33.94 0 top
TP111  74.64,39.02 0 top
TP112  69.56,36.48 0 top
TP118  51.78,33.94 0 top
TP119  59.4,33.94 0 top
TP120  67.02,33.94 0 top
TP121  61.94,28.86 0 top
TP122  69.56,31.4 0 top
TP123  67.02,31.4 0 top
TP124  69.56,26.32 0 top
TP125  56.86,18.7 0 top
TP126  59.4,46.64 0 top
TP127  59.4,18.7 0 top
TP128  54.32,16.16 0 top
TP134  72.1,31.4 0 top
TP135  72.1,26.32 0 top
TP136  64.48,28.86 0 top
TP137  67.02,28.86 0 top
TP138  69.56,28.86 0 top
TP139  72.1,28.86 0 top
TP140  74.64,28.86 0 top
TP141  54.32,26.32 0 top
TP142  51.78,26.32 0 top
TP143  54.32,28.86 0 top
TP144  51.78,28.86 0 top
TP150  74.64,23.78 0 top
TP151  74.64,26.32 0 top
TP152  67.02,26.32 0 top
TP153  56.86,26.32 0 top
TP154  64.48,21.24 0 top
TP155  61.94,21.24 0 top
TP156  59.4,21.24 0 top
TP157  56.86,21.24 0 top
TP158  69.56,23.78 0 top
TP159  67.02,23.78 0 top
TP160  64.48,23.78 0 top
TP166  61.94,44.1 0 top
TP167  64.48,44.1 0 top
TP168  67.02,44.1 0 top
TP169  69.56,44.1 0 top
TP170  69.56,39.02 0 top
TP171  54.32,39.02 0 top
TP172  59.4,41.56 0 top
TP173  61.94,41.56 0 top
TP174  64.48,41.56 0 top
TP175  72.1,41.56 0 top
TP176  74.64,44.1 0 top
TP182  54.32,36.48 0 top
TP183  54.32,33.94 0 top
TP184  67.02,41.56 0 top
TP185  69.56,41.56 0 top
TP186  49.24,46.64 0 top
TP187  74.64,46.64 0 top
TP188  54.32,41.56 0 top
TP189  56.86,41.56 0 top
TP190  61.94,33.94 0 top
TP191  54.32,18.7 0 top
TP192  54.32,31.4 0 top
TP198  74.64,41.56 0 top
TP199  54.32,23.78 0 top
TP200  74.64,33.94 0 top
TP201  56.86,28.86 0 top
TP202  67.02,39.02 0 top
TP203  56.86,33.94 0 top
TP204  56.86,31.4 0 top
TP205  61.94,46.64 0 top
TP206  56.86,23.78 0 top
TP207  59.4,23.78 0 top
TP208  61.94,23.78 0 top
TP214  54.32,21.24 0 top
TP215  59.4,44.1 0 top
TP216  56.86,39.02 0 top
TP217  59.4,39.02 0 top
TP218  61.94,39.02 0 top
TP219  64.48,39.02 0 top
TP220  74.64,31.4 0 top
TP221  51.78,41.56 0 top
TP222  51.78,46.64 0 top
TP223  49.24,51.72 0 top
TP224  56.86,49.18 0 top
TP230  64.48,49.18 0 top
TP231  54.32,49.18 0 top
TP232  51.78,49.18 0 top
TP233  49.24,49.18 0 top
TP234  74.64,51.72 0 top
TP235  49.24,59.34 0 top
TP236  59.4,49.18 0 top
TP237  49.24,39.02 0 top
TP238  49.24,54.26 0 top
TP239  67.02,49.18 0 top
TP240  72.1,49.18 0 top
TP246  49.24,44.1 0 top
TP247  49.24,41.56 0 top
TP248  49.24,56.8 0 top
TP249  69.56,49.18 0 top
TP250  49.24,36.48 0 top
TP251  49.24,33.94 0 top
TP252  49.24,31.4 0 top
TP253  49.24,28.86 0 top
TP254  49.24,26.32 0 top
TP255  49.24,23.78 0 top
TP256  51.78,56.8 0 top
TP262  54.32,59.34 0 top
TP263  56.86,59.34 0 top
TP264  54.32,54.26 0 top
TP265  56.86,54.26 0 top
TP266  59.4,54.26 0 top
TP267  61.94,49.18 0 top
TP268  54.32,46.64 0 top
TP269  51.78,59.34 0 top
TP270  59.4,59.34 0 top
TP271  61.94,59.34 0 top
TP272  64.48,59.34 0 top
TP278  69.56,59.34 0 top
TP279  72.1,59.34 0 top
TP280  74.64,59.34 0 top
TP281  61.94,54.26 0 top
TP282  69.56,54.26 0 top
TP283  72.1,54.26 0 top
TP284  74.64,54.26 0 top
TP285  72.1,44.1 0 top
TP286  64.48,54.26 0 top
TP287  67.02,54.26 0 top
TP288  67.02,59.34 0 top
TP294  56.86,44.1 0 top
TP295  54.32,56.8 0 top
TP296  56.86,56.8 0 top
TP297  59.4,56.8 0 top
TP298  61.94,56.8 0 top
TP299  64.48,56.8 0 top
TP300  59.4,51.72 0 top
TP301  74.64,49.18 0 top
TP302  51.78,51.72 0 top
TP303  54.32,44.1 0 top
TP304  54.32,51.72 0 top
TP310  56.86,13.62 0 top
TP311  51.78,13.62 0 top
TP312  49.24,13.62 0 top
TP313  67.02,13.62 0 top
TP314  64.48,13.62 0 top
TP315  61.94,13.62 0 top
TP316  59.4,13.62 0 top
TP317  54.32,13.62 0 top
TP318  69.56,13.62 0 top
TP319  72.1,13.62 0 top
TP320  74.64,13.62 0 top

### Tracks (layer width: path | path; a pad name or v marks a point on that pad's centre or on a via)
GND  (via drill 0.58, 0.6)  (39 unrouted)
  Top 0.254: 20.74,61 IC1.20 | 21.34,60.93 IC1.19 | 23.11,60.93 IC1.17 | IC1.9 25.15,53.28 25.15,53.05 | IC1.31 16.05,54.58 16.76,54.58 17.78,55.59 v17.78,56.36 16.17,56.36 IC1.29 | IC6.21 39.98,39.34 v41.66,39.34 | IC6.3 31.17,40.1 29.46,40.1 v29.21,40.35 | IC6.5 31.14,38.32 v28.96,38.32 | IC1.22 19.05,60.98 19.05,61.94
  Top 0.813: 20.57,63.21 20.83,62.96 20.83,61.44 20.74,61 21.08,60.93 21.34,60.93 | 20.57,63.21 20.32,63.47 C8.2 20.32,69.31 R12.1 | v22.35,62.45 22.35,61.44 22.32,60.94 | IC1.18 22.32,60.94 | 23.11,60.93 22.61,60.93 22.32,60.94 | IC4.2 v36.83,54.58 | v13.72,43.91 13.72,44.93 R16.2 | R8.1 v34.29,65.5 | v14.99,9.87 15.75,9.87 C3.1 | v22.35,35.02 22.35,36.04 C9.2 | v10.16,51.53 C7.2 | v19.3,49.24 19.3,48.48 C6.2 | C4.2 28.7,54.32 v29.46,54.32 29.46,52.55 29.21,52.29 29.21,52.04 27.94,50.77 27.43,50.77 25.15,53.05 | v36.58,47.97 36.58,47.21 C12.2 | v21.84,6.57 22.61,6.57 IC3.8 | v31.5,7.84 30.73,7.84 IC3.10 | v31.5,14.19 30.73,14.19 IC3.15 | v16.51,34.26 16.51,33.24 IC2.5 | v10.67,57.88 Q1.2 | 19.05,61.94 20.32,63.21 20.57,63.21
  Bottom 0.254: v17.78,56.36 17.78,57.12 | v41.66,39.34 41.4,39.34 | 28.96,39.59 v29.21,40.35 | v28.96,38.32 28.7,38.07
  Bottom 0.813: P5.6 30.99,59.15 29.21,57.37 29.21,54.58 v29.46,54.32
  pour Bottom: 0,76.93 88.9,76.93 88.9,2 0,2
N$1
  Top 0.813: R11.2 14.22,69.56 16,71.34 16,71.85 IC5.2
  Bottom 0.813: J1.1 29.97,73.37 29.97,75.91 16,75.91 16,74.39 IC5.2
N$2  (via drill 0.58)
  Top 0.254: 35.81,52.29 IC4.3 35.81,53.31
  Top 0.813: v15.24,68.8 15.24,67.79 D1.C | 35.81,52.29 35.81,50.77 IC4.4 | 35.81,53.31 35.56,53.56 v35.56,54.58 | v35.56,57.12 31.5,57.12 31.5,57.37 29.46,57.37 28.45,58.39 28.45,62.2 30.23,63.98 30.23,66.26 C10.1 | v23.88,71.34 23.88,71.85 19.56,71.85 IC5.3
  Bottom 0.813: v15.24,68.8 16.76,70.33 19.56,70.33 19.56,71.85 IC5.3 | v35.56,57.12 v35.56,54.58 | v23.88,71.34 26.16,69.06 30.73,69.06 30.99,68.8 30.99,67.53 30.73,67.53 C10.1
N$3
  Top 0.813: D1.A 10.67,65.75 9.65,64.74 P2.+
N$4
  Top 0.254: R11.1 12.45,69.56 12.45,70.83 13.46,71.85 IC5.1 14.48,74.39 14.48,75.15 17.02,75.15 17.78,74.39 17.78,71.85 17.53,71.6 17.53,69.56 R12.2
N$5  (via drill 0.58)
  Top 0.254: v19.81,53.82 22.35,53.82 22.86,53.31 22.86,53.05 23.11,52.8 IC1.8 | v15.75,51.02 14.22,49.5 14.22,49.24 R4.2
  Bottom 0.254: v19.81,53.82 18.03,52.04 17.02,52.04 16,51.02 v15.75,51.02
N$6
  Top 0.254: IC1.27 15.49,57.88 14.48,57.88 14.48,58.64 13.97,59.15 Q1.3
N$7  (via drill 0.58)
  Top 0.254: v10.16,49.24 11.18,49.24 R4.1
  Bottom 0.254: v10.16,49.24 8.89,50.51 7.87,50.51 P3.2
N$8
  Top 0.254: R5.1 11.18,47.97 8.38,47.97 8.38,48.48 7.87,48.99 5.59,48.99 5.59,49.75 P3.3
N$9  (via drill 0.58)
  Top 0.254: IC1.7 22.35,51.78 22.35,51.53 25.15,48.74 25.65,48.74 25.65,47.97 R6.1 25.65,47.47 25.65,45.43 v20.07,45.43 | v16,48.23 16,47.97 14.22,47.97 R5.2
  Bottom 0.254: v16,48.23 16.51,47.72 17.78,47.72 v20.07,45.43
N$10
  Top 0.254: IC1.28 15.49,56.86 13.97,56.86 13.97,56.61 Q1.1
N$11  (via drill 0.58)
  Top 0.813: 7.62,46.45 7.62,47.21 P3.1 | 7.62,46.45 R3.1 | v15.49,64.74 11.18,60.42 10.16,60.42 10.16,59.15 8.89,57.88 8.89,56.1 3.81,51.02 3.81,46.96 4.57,46.2 7.37,46.2 7.62,46.45
  Bottom 0.813: v15.49,64.74 23.37,72.61 24.89,72.61 24.89,72.87 J1.3
N$12
  Top 0.254: 14.73,46.7 14.22,46.7 R3.2 | 14.73,46.7 15.75,46.7 17.02,47.97 17.02,48.23 19.81,51.02 19.81,51.78 IC1.4 | 14.73,46.7 14.73,42.89 13.46,42.89 12.45,43.91 12.45,44.93 R16.1
N$13
  Top 0.254: IC1.5 20.57,51.78 20.57,49.24 20.32,48.99 20.32,46.45 23.88,46.45 23.88,47.47 R6.2
N$14
  Top 0.254: R8.2 LED3.C
N$15
  Top 0.254: C5.2 17.27,15.21 17.78,14.7 22.35,14.7 22.35,14.45 22.61,14.19 IC3.2
N$16
  Top 0.254: IC1.30 15.49,55.34 14.22,55.34 14.22,54.32 R7.2 13.72,53.82 13.72,52.29 C7.1
N$17
  Top 0.254: IC1.6 21.59,51.78 21.59,48.48 C6.1
N$18
  Top 0.254: C3.2 17.27,11.4 17.78,10.89 17.78,8.86 22.61,8.86 IC3.6
N$19  (via drill 0.58, 0.6)
  Top 0.254: IC6.16 38.35,35.02 42.42,35.02 43.69,36.29 43.69,43.15 42.67,44.16 42.67,47.21 v42.93,47.47 | v80.01,67.53 80.77,68.55 86.87,68.55 87.38,68.04 87.38,29.94 86.61,29.18 P6.6 | v41.4,65.5 41.15,65.25 41.15,63.72 v40.64,63.21 40.13,62.71 40.13,52.8 39.88,52.55 v39.88,47.47
  Bottom 0.254: v40.64,63.21 39.12,61.69 P5.1 | v80.01,67.53 80.01,68.55 77.98,70.58 75.69,70.58 75.18,70.07 46.23,70.07 45.72,70.58 42.42,70.58 41.4,69.56 v41.4,65.5 | v42.93,47.47 v39.88,47.47
N$20
  Top 0.254: C1.1 19.81,13.18 22.61,13.18 22.61,12.92 IC3.3
N$21
  Top 0.254: C1.2 19.81,15.46 22.61,15.46 IC3.1
N$22
  Top 0.254: C2.1 19.81,11.65 22.61,11.65 IC3.4
N$23
  Top 0.254: C2.2 19.81,10.13 22.61,10.13 IC3.5
N$24  (via drill 0.58)
  Top 0.254: v35.56,36.04 36.83,36.04 37.34,35.53 37.34,35.02 IC6.15 | v77.22,73.12 76.71,72.61 76.71,66.26 77.22,65.75 77.22,56.61 80.77,53.05 80.77,47.72 85.85,47.72 86.61,46.96 86.61,43.4 83.82,40.61 83.82,27.4 84.58,26.64 P6.5 | v44.45,73.12 38.1,73.12 38.1,66.01 34.29,62.2 34.29,61.18 33.02,59.91 P5.4
  Bottom 0.254: v44.45,73.12 v77.22,73.12 | v35.56,36.04 35.56,37.56 33.78,39.34 32.26,39.34 28.96,42.64 27.94,42.64 26.42,44.16 26.42,53.31 32,53.31 33.02,54.32 P5.4
N$25  (via drill 0.58, 0.6)
  Top 0.254: v37.85,36.29 37.85,36.04 39.37,36.04 IC6.17 | v28.7,43.91 30.48,45.69 30.48,54.07 v30.99,54.58 | v77.22,31.46 76.2,32.48 76.2,65.25 69.34,72.1 v67.82,72.1 | v32.51,70.83 v32.51,64.23 33.02,63.72 P5.3
  Bottom 0.254: v37.85,36.29 37.59,36.54 37.34,36.54 34.04,39.85 34.04,40.61 32.51,42.13 30.48,42.13 v28.7,43.91 | v77.22,31.46 84.33,31.46 P6.7 | v32.51,70.83 33.78,72.1 45.47,72.1 45.97,72.61 47.75,72.61 48.01,72.36 48.26,72.36 48.51,72.1 v67.82,72.1 | P5.3 31.75,60.17 31.75,58.13 30.99,57.37 v30.99,54.58
N$26
  Top 0.254: IC6.29 35.31,43.66 35.31,44.93 35.56,45.18 35.56,48.23 37.08,49.75 37.08,51.28 37.59,51.78 38.35,51.78 38.61,52.04 38.61,54.07 37.59,55.09 37.59,59.66 36.83,60.42 34.29,60.42 34.29,58.64 33.53,57.88 32.26,57.88 31.75,58.39 31.75,60.42 P5.5
N$27  (via drill 0.58, 0.6)
  Top 0.254: v42.93,29.69 41.66,30.96 41.66,33.5 v41.15,34 | IC6.30 34.54,42.64 34.54,41.88 34.8,41.62 v34.8,41.37 | v83.31,15.21 83.31,21.05 84.33,22.07 86.36,22.07 87.38,23.08 87.38,24.61 84.84,24.61 83.31,26.13 83.31,36.04 81.79,37.56 81.79,45.18 82.55,45.94 P7.3 | v45.72,11.4 45.21,11.91 v45.21,27.4 | P4.11 30.48,31.21 30.48,28.67 P4.7
  Bottom 0.254: v41.15,34 41.15,35.53 38.86,37.81 37.85,37.81 36.32,39.34 36.32,40.35 35.31,41.37 v34.8,41.37 | P4.7 29.72,27.91 30.99,27.91 32.77,29.69 v42.93,29.69 v45.21,27.4 | v83.31,15.21 79.5,11.4 v45.72,11.4
N$28  (via drill 0.58, 0.6)
  Top 0.254: v34.04,37.31 34.04,39.85 33.78,40.1 33.78,42.64 IC6.31 | v76.2,30.19 77.72,28.67 77.72,13.43 71.63,7.33 49.53,7.33 49.53,11.14 47.75,12.92 v47.75,22.57 | P4.9 27.94,31.21 27.94,32.99 29.97,35.02 v30.23,35.02 30.99,34.26 30.99,26.64 P4.5
  Bottom 0.254: v76.2,30.19 76.2,32.23 76.71,32.23 76.71,43.66 81.03,47.97 82.55,47.97 82.55,48.48 P7.5 | v47.75,22.57 31.24,22.57 P4.5 | 30.48,32.23 30.48,31.21 P4.9 | v34.04,37.31 34.04,35.27 32.77,34 31.24,34 v30.23,35.02
N$29  (via drill 0.58)
  Top 0.254: v34.29,44.67 33.53,44.67 32.77,43.91 32.77,43.66 IC6.32 | R13.1 42.16,66.52 42.42,66.26 42.42,65.25 41.66,64.48 41.66,62.71 40.64,61.69 40.64,50.01 40.89,49.75 40.89,45.18 v40.39,44.67 | P7.7 82.55,52.04 79.76,54.83 79.76,58.39 78.74,59.15 78.74,68.04 79.25,68.55 79.25,76.68 45.47,76.68 45.47,72.87 43.18,70.58 43.18,68.29 41.91,67.02 R13.1 | R13.1 42.16,67.28
  Bottom 0.254: v34.29,44.67 34.8,44.16 39.88,44.16 v40.39,44.67
N$30  (via drill 0.58)
  Top 0.254: v33.02,38.32 33.02,41.37 32.77,41.62 31.75,41.62 IC6.1 | v31.75,35.02 32,34.77 32,28.42 32.26,28.16 32.26,18.26 35.56,14.95 35.56,9.37 36.58,8.35 42.93,8.35 42.93,6.57 43.94,5.56 72.64,5.56 75.18,7.59 75.18,9.87 75.95,10.64 78.23,13.18 78.23,42.64 79.25,43.66 v79.25,47.72
  Bottom 0.254: v31.75,35.02 33.02,35.78 v33.02,38.32 | v79.25,47.72 81.79,50.26 84.07,50.26 84.07,53.56 83.31,53.56 P7.9
N$31  (via drill 0.58)
  Top 0.254: v30.73,43.15 30.23,42.64 30.23,40.86 30.73,40.86 IC6.2 | v27.43,46.45 27.43,49.5 22.1,54.83 22.1,58.39 23.88,60.17 23.88,62.71 21.59,64.99 21.59,67.79 26.67,72.87 26.67,73.37 29.21,75.91 v44.45,75.91 | v51.05,74.14 60.71,64.99 v75.18,64.99 | v80.77,59.91 81.28,59.4 81.28,57.63 82.55,56.36 P7.11
  Bottom 0.254: v30.73,43.15 v27.43,46.45 | v44.45,75.91 44.96,75.41 49.78,75.41 v51.05,74.14 | v75.18,64.99 80.26,59.91 v80.77,59.91
N$32  (via drill 0.58, 0.6)
  Top 0.254: v39.62,34 40.89,32.73 40.89,16.48 39.62,15.21 R15.2 JP1.1 | v35.31,39.85 35.81,40.35 35.81,42.39 36.07,42.64 IC6.28 36.07,43.25 36.07,44.67 36.58,45.18 v37.85,45.18 | v51.82,65.25 51.56,64.99 48.01,64.99 47.24,64.23 47.24,45.69 v46.74,45.18
  Bottom 0.254: v39.62,34 39.62,35.78 38.35,37.31 37.59,37.31 35.31,39.59 v35.31,39.85 | P7.14 84.3,60.42 81.53,60.42 75.95,66.01 52.32,66.01 51.82,65.5 v51.82,65.25 | v37.85,45.18 38.86,45.18 39.37,45.69 41.4,45.69 41.91,45.18 v46.74,45.18
N$33  (via drill 0.58, 0.6)
  Top 0.254: v37.34,40.35 36.58,41.12 36.58,42.64 IC6.27 | v35.05,26.13 35.05,16.73 36.58,15.21 R14.2 JP1.3 | v80.77,63.98 80.77,62.71 81.53,61.94 81.53,60.42 83.31,60.42 84.07,59.66 84.07,59.15 84.58,58.64 84.58,57.63 85.09,57.12 P7.12 | v45.72,40.61 45.21,41.12 45.21,49.75 44.7,50.26 44.7,51.02 45.72,52.04 45.72,62.45 v44.96,63.21 | v37.85,26.13 v37.85,32.99
  Bottom 0.254: v80.77,63.98 80.52,63.98 76.96,67.53 47.24,67.53 46.23,66.52 46.23,64.48 v44.96,63.21 | v37.85,32.99 41.66,32.99 42.16,33.5 42.16,35.27 39.12,38.32 38.35,38.32 37.34,39.34 v37.34,40.35 37.85,40.35 39.12,41.62 44.96,41.62 45.97,40.61 v45.72,40.61 | v35.05,26.13 v37.85,26.13
N$34  (via drill 0.58, 0.6)
  Top 0.254: v37.59,41.62 37.59,42.64 IC6.26 | v46.74,71.6 47.75,72.61 47.75,74.9 49.02,76.17 77.98,76.17 78.74,75.66 78.74,68.8 78.23,68.29 78.23,58.13 78.49,57.88 v78.74,57.88 | v82.3,57.88 84.07,57.88 84.07,56.36 85.09,55.34 85.09,54.58 P7.10 | v41.66,55.59 v41.66,60.67
  Bottom 0.254: v37.59,41.62 35.56,43.66 33.78,43.66 32,45.43 32,45.94 32.77,46.7 33.27,46.7 38.35,51.78 39.37,51.78 v41.66,55.59 | v46.74,71.6 37.08,71.6 37.08,65.75 38.35,64.48 40.89,64.48 41.66,63.72 v41.66,60.67 | v78.74,57.88 v82.3,57.88
N$35  (via drill 0.58)
  Top 0.254: v40.64,70.07 40.39,69.82 40.39,66.26 39.62,65.5 39.62,53.05 39.37,52.8 39.37,51.28 38.86,50.77 v38.86,48.48 | v81.53,67.28 82.3,68.04 86.61,68.04 86.61,52.8 85.85,52.04 P7.8 | IC6.25 38.35,43.66 38.86,44.16 38.86,45.94 v38.35,46.45
  Bottom 0.254: v38.35,46.45 38.86,46.96 v38.86,48.48 | v81.53,67.28 81.53,67.79 78.23,71.09 74.93,71.09 74.68,70.83 74.68,70.58 46.48,70.58 45.97,71.09 41.66,71.09 v40.64,70.07
N$36  (via drill 0.58, 0.6)
  Top 0.254: v39.88,42.64 39.88,41.62 IC6.24 | v44.2,69.31 44.2,68.55 42.93,67.28 42.93,64.99 42.16,64.23 42.16,61.69 42.67,61.18 42.67,50.51 41.91,49.75 41.91,43.66 v42.42,42.89 | v77.72,69.56 77.72,57.63 v78.74,56.61 | v80.77,56.61 82.04,55.34 84.33,55.34 84.33,50.26 85.09,49.5 P7.6
  Bottom 0.254: v39.88,42.64 40.13,42.89 v42.42,42.89 | v44.2,69.31 44.7,69.56 v77.72,69.56 | v78.74,56.61 v80.77,56.61
N$37  (via drill 0.58)
  Top 0.254: v38.35,39.59 38.35,40.61 39.37,40.61 IC6.23 | v46.23,32.99 46.74,32.48 46.74,10.38 v47.75,9.37 | v77.22,9.87 80.77,13.68 v80.77,28.42 | v79.25,29.94 v79.25,37.56
  Bottom 0.254: v46.23,32.99 v38.35,39.59 | v47.75,9.37 48.26,9.87 v77.22,9.87 | v80.77,28.42 v79.25,29.94 | v79.25,37.56 84.07,42.39 84.07,45.94 85.09,45.94 P7.4
N$38  (via drill 0.58, 0.6)
  Top 0.254: v80.52,66.26 81.79,65.5 85.09,65.5 85.09,64.74 P7.18 | IC6.22 40.39,40.1 40.89,40.1 v41.4,40.61 | v45.47,68.04 45.47,67.28 44.7,66.52 44.7,64.99 43.18,63.47 43.18,62.71 43.69,62.2 43.69,50.51 44.7,49.5 44.7,39.85 v45.21,39.34
  Bottom 0.254: v45.47,68.04 45.97,68.55 77.47,68.55 79.5,66.52 v80.52,66.26 | v41.4,40.61 42.42,40.61 43.69,39.34 v45.21,39.34
N$39  (via drill 0.58)
  Top 0.254: v41.66,50.77 41.4,50.77 41.4,42.64 43.18,40.86 43.18,38.58 42.42,37.81 40.39,37.81 IC6.19 | v45.72,50.77 46.23,51.28 46.23,64.99 v47.75,66.52 | v81.79,62.96 85.09,62.96 85.09,62.2 P7.16
  Bottom 0.254: v41.66,50.77 v45.72,50.77 | v47.75,66.52 48.26,67.02 76.71,67.02 79.76,63.98 79.76,63.72 80.52,62.96 v81.79,62.96
N$40
  Top 0.254: R9.1 23.88,42.39 21.84,42.39 R10.1 21.34,42.13 19.56,40.35 19.56,31.21 23.11,31.21 23.11,32.48 22.61,32.99 IC2.4
N$41  (via drill 0.58)
  Top 0.254: v39.88,18.51 36.83,21.56 36.83,34 IC6.14 | v41.91,16.48 44.2,14.19 44.2,10.89 48.26,6.83 72.39,6.83 74.17,8.35 v74.17,8.6 | v76.71,8.6 78.74,8.6 82.3,13.43 82.3,20.8 84.58,23.08 P6.4
  Bottom 0.254: v41.91,16.48 v39.88,18.51 | v74.17,8.6 v76.71,8.6
N$42  (via drill 0.58)
  Top 0.254: v36.07,19.27 36.07,34 IC6.13 | v83.31,13.94 86.36,13.94 87.38,14.95 87.38,19.78 86.61,20.54 P6.3
  Bottom 0.254: v36.07,19.27 44.96,10.38 75.18,10.38 75.69,10.89 80.26,10.89 v83.31,13.94
N$43  (via drill 0.58)
  Top 0.254: v34.8,28.67 35.05,28.92 35.05,34 IC6.12 | v43.69,27.65 44.7,26.64 44.7,11.14 47.5,8.35 v48.51,8.35 | v50.55,8.35 71.63,8.35 76.71,13.43 v76.71,17.75
  Bottom 0.254: v34.8,28.67 35.31,29.18 42.16,29.18 v43.69,27.65 | v48.51,8.35 v50.55,8.35 | v76.71,17.75 81.53,22.57 82.04,22.57 83.06,21.56 83.06,18.76 84.33,18.76 P6.2
N$44  (via drill 0.6)
  Top 0.254: v43.94,67.02 43.94,64.99 42.67,63.72 42.67,62.45 43.18,61.94 43.18,50.26 44.2,49.24 44.2,35.53 42.93,34.26 v42.93,31.97 | IC6.11 34.29,34.44 34.29,32.99 v34.04,32.73
  Bottom 0.254: P7.17 82.01,65.25 80.01,65.25 77.22,68.04 46.74,68.04 45.72,67.02 v43.94,67.02 | v34.04,32.73 34.8,31.97 v42.93,31.97
N$45  (via drill 0.6)
  Top 0.254: v50.8,66.01 50.29,65.5 47.5,65.5 46.74,64.74 46.74,46.45 45.72,45.43 45.72,44.93 47.24,43.4 47.24,36.04 44.45,33.24 44.45,31.46 v43.94,30.96 | v33.78,30.96 33.02,31.72 33.02,32.99 33.53,33.5 33.53,34.51 33.58,34.51 IC6.10
  Bottom 0.254: P7.15 81,61.69 80.52,62.2 76.2,66.52 51.82,66.52 51.31,66.01 v50.8,66.01 | v33.78,30.96 v43.94,30.96
N$46  (via drill 0.58)
  Top 0.254: v34.8,27.4 32.51,29.69 32.51,34 IC6.9 | v48.26,63.98 47.75,63.47 47.75,35.78 44.96,32.99 44.96,30.19 43.43,28.67 42.42,28.67 v41.91,28.16
  Bottom 0.254: v34.8,27.4 35.56,28.16 v41.91,28.16 | v48.26,63.98 75.44,63.98 80.52,58.9 82.55,58.9 P7.13
N$47  (via drill 0.58, 0.6)
  Top 0.254: v33.02,45.69 32,45.69 29.46,43.15 29.46,42.39 v28.7,41.62 | v80.26,36.54 80.26,52.29 76.71,55.85 76.71,65.5 76.2,66.01 76.2,75.66 49.28,75.66 48.26,74.64 48.26,69.31 45.21,66.26 45.21,64.74 43.69,63.21 43.69,62.96 44.2,62.45 44.2,55.59 44.7,55.09 v44.7,53.56 | IC6.7 30.73,36.8 v27.94,36.8
  Bottom 0.254: v33.02,45.69 38.35,51.02 40.39,51.02 41.66,52.29 43.43,52.29 v44.7,53.56 | v80.26,36.54 82.8,34 84.33,34 P6.8 | v28.7,41.62 27.69,40.61 27.69,37.05 v27.94,36.8
N$48  (via drill 0.58)
  Top 0.254: 30.73,36.04 30.99,36.04 | v27.94,34.77 29.21,36.04 30.73,36.04 | v24.38,32.73 24.89,32.23 24.89,16.22 26.16,14.95 26.16,7.84 29.72,4.29 72.64,4.29 75.69,6.57 75.69,9.62 78.74,12.92 78.74,27.65 80.26,29.18 80.26,34.26 v82.04,36.04 | 30.73,36.04 IC6.8
  Bottom 0.254: v24.38,32.73 25.91,34 27.18,34 v27.94,34.77 | v82.04,36.04 84.33,36.04 P6.9
N$49  (1 unrouted)
  Top 0.254: 37.85,49.75 IC4.5 37.82,50.26 37.85,50.26 37.85,48.23 39.37,46.7 39.37,44.42 40.89,42.89 40.89,42.39 42.67,40.61 42.67,38.83 42.16,38.32 39.88,38.32 39.88,38.42 IC6.20
N$50
  Top 0.254: R13.2 LED4.C
N$51  (via drill 0.58, 0.6)
  Top 0.254: v20.57,55.09 20.57,57.63 18.8,59.4 16.51,59.4 IC1.25 | P4.12 26.92,32.73 26.92,39.08 26.42,39.59 v25.4,39.59
  Bottom 0.254: v20.57,55.09 21.84,53.82 21.84,52.04 24.89,48.99 24.89,40.1 v25.4,39.59 | P4.3 28.7,22.83 28.7,23.59 25.4,23.59 24.89,24.1 24.89,31.97 26.16,31.97 P4.12
N$52  (via drill 0.58)
  Top 0.254: v19.05,66.52 17.78,65.25 17.78,61.69 17.53,61.44 IC1.24 | P4.1 27.94,21.05 27.94,28.67 P4.10 25.4,31.21 25.4,34 25.91,34.51 v25.91,38.32
  Bottom 0.254: v19.05,66.52 19.05,67.02 19.3,67.02 19.81,67.53 23.37,67.53 28.7,62.2 28.7,61.69 25.91,58.9 25.91,40.61 26.42,40.1 26.42,38.83 v25.91,38.32
N$53
  Top 0.254: R1.1 LED1.C
N$54
  Top 0.254: R2.1 LED2.C
N$55  (via drill 0.58)
  Top 0.254: v27.69,52.29 26.67,53.31 26.67,55.34 25.15,55.34 IC1.11 | v38.61,55.59 38.61,65.5 39.62,66.52 R2.2
  Bottom 0.254: v27.69,52.29 27.94,52.8 36.83,52.8 v38.61,55.59
N$56  (via drill 0.58)
  Top 0.254: v23.11,58.13 23.11,56.36 24.13,56.36 IC1.12 | v27.18,62.2 29.21,64.23 29.21,69.06 33.02,72.87 35.56,72.87 35.56,68.29 36.58,67.28 R1.2
  Bottom 0.254: v23.11,58.13 v27.18,62.2
N$57  (via drill 0.58)
  Top 0.254: v17.53,54.07 17.53,52.8 IC1.1 | v15.75,45.69 18.54,42.89 18.54,30.19 20.07,28.67 23.11,28.67 23.11,29.94 22.61,30.45 IC2.2
  Bottom 0.254: v17.53,54.07 16,52.55 15.49,52.55 14.48,51.53 14.48,45.69 v15.75,45.69
N$58  (via drill 0.58)
  Top 0.254: v16.76,50.26 16.76,53.56 16.51,53.82 IC1.32 | v17.02,46.7 19.05,44.67 19.05,30.96 20.57,29.43 IC2.1
  Bottom 0.254: v16.76,50.26 14.99,48.48 14.99,46.7 v17.02,46.7
N$59  (via drill 0.58)
  Top 0.254: v18.29,50.77 18.29,51.78 IC1.2 | v22.86,41.37 21.84,40.35 R10.2 21.34,40.61 20.07,39.34 20.07,32.48 20.57,31.97 IC2.3
  Bottom 0.254: v18.29,50.77 18.29,47.97 18.8,47.97 22.86,43.91 v22.86,41.37
N$60  (via drill 0.58)
  Top 0.254: v31.5,12.92 30.73,12.92 IC3.14
  Bottom 0.254: v31.5,12.92 28.96,15.46 23.37,15.46 14.48,24.35 13.21,24.35 P1.3
N$61  (via drill 0.58)
  Top 0.254: v27.69,16.48 27.69,11.65 28.96,11.65 IC3.13
  Bottom 0.254: v27.69,16.48 27.43,16.73 23.37,16.73 13.72,26.38 13.72,27.15 13.21,27.15 P1.2
N$62
  Top 0.254: P4.8 P4.6 P4.4 P4.2 26.67,10.38 28.96,10.38 IC3.12 29.97,10.13 29.97,9.11 IC3.11
VCC  (via drill 0.58, 0.6)
  Top 0.254: IC1.14 24.64,57.63 24.64,57.12 IC1.13 25.15,57.12 25.91,57.12 | v16,60.42 15.24,60.42 14.73,59.91 14.73,59.15 15.24,58.64 15.99,58.64 IC1.26 16.05,58.64 17.53,58.64 18.8,57.37 18.8,53.31 19.05,53.05 19.05,52.29 19.1,52.29 IC1.3 | 28.19,39.34 27.43,40.1 27.43,40.86 | IC6.4 31.14,39.08 30.23,39.08 29.97,39.34 28.19,39.34 | 28.19,39.34 27.94,39.08 27.94,38.07 28.7,37.31 29.97,37.31 30.23,37.56 31.17,37.56 IC6.6 31.24,37.64 31.24,37.56 32.26,37.56 32.51,37.31 32.51,36.54 33.02,36.04 34.29,36.04 35.31,37.05 36.83,37.05 37.08,37.31 38.35,37.31 38.61,37.05 38.86,37.05 39.04,36.87 IC6.18
  Top 0.813: 14.99,18 14.99,28.67 | 14.99,18 14.99,14.19 15.75,14.19 C5.1 | 14.99,28.67 15.49,29.18 IC2.8 | 14.73,31.72 15.49,31.72 IC2.6 | 14.73,31.72 14.73,28.92 14.99,28.67 | 38.1,16.99 39.12,16.99 R15.1 | 38.1,16.99 37.08,16.99 R14.1 | 33.78,14.7 33.78,8.1 36.32,5.56 38.86,5.56 38.86,6.83 JP1.2 | 33.78,14.7 33.78,15.46 30.73,15.46 IC3.16 | v38.1,15.97 38.1,16.99 | v34.54,14.7 33.78,14.7 | 14.99,18 v23.88,18 | C9.1 22.35,38.32 23.88,39.85 R9.2 24.38,40.86 27.43,40.86 27.43,44.67 29.46,46.7 v29.46,47.72 | C12.1 34.04,47.21 v31.5,49.75 32.51,50.77 32.51,55.85 | P5.2 36.83,58.13 36.83,56.1 36.58,55.85 32.51,55.85 | 32.51,55.85 29.21,55.85 28.7,56.36 C4.1 27.18,56.86 27.18,57.12 25.91,57.12 25.91,61.94 23.11,64.74 C8.1 23.11,66.26 23.11,68.04 27.69,72.61 J1.2 28.19,73.63 29.21,74.64 33.53,74.64 LED3.A 35.05,74.64 36.07,74.64 LED1.A 37.59,74.64 38.61,74.64 LED2.A 40.13,74.64 41.15,74.64 LED4.A 42.67,74.39 v44.45,74.39 | v81.79,21.56 82.04,21.81 v82.04,32.99 | P7.1 P7.2 | TP16.1 73.66,61.94 73.15,61.94 TP14.1 71.12,61.94 70.61,61.94 TP12.1 68.58,61.94 68.07,61.94 TP10.1 66.04,61.94 65.53,61.94 TP9.1 63.5,61.94 62.99,61.94 TP7.1 60.96,61.94 60.45,61.94 TP8.1 58.42,61.94 57.91,61.94 TP6.1 55.88,61.94 55.37,61.94 TP11.1 | TP15.1 50.29,61.94 50.8,61.94 TP13.1 52.83,61.94 53.34,61.94 TP11.1 | v10.92,55.34 10.92,54.58 11.18,54.32 R7.1 | v77.72,43.4 77.22,43.4 v77.22,54.07 | v10.16,45.18 10.16,44.42 14.73,39.85 14.73,31.72 | TP11.1 54.36,61.92 54.36,69.06 v49.28,74.14
  Bottom 0.254: v16,60.42 16.26,60.67
  Bottom 0.813: v38.1,15.97 36.83,14.7 v34.54,14.7 31.5,17.75 24.13,17.75 v23.88,18 | v31.5,49.75 v29.46,47.72 | v81.79,21.56 81.79,18.76 83.31,17.24 84.58,17.24 84.58,16.48 P6.1 | v82.04,32.99 77.98,37.05 77.98,43.4 | 77.98,43.4 82.55,43.4 P7.1 | v16,60.42 v10.92,55.34 11.18,55.09 11.43,55.09 11.43,46.45 v10.16,45.18 | 16.26,60.67 18.8,63.21 21.34,63.21 21.84,63.72 21.84,64.74 22.61,64.74 C8.1 | v49.28,74.14 48.77,74.39 v44.45,74.39 | v77.22,54.07 77.22,60.93 76.96,61.18 75.44,61.18 TP16.1 | v77.72,43.4 77.98,43.4

### Text on the board
tNames: 5V | Tx | Rx | SW | USB | INT | LBM 20060102 | PD7 | PC7 | PD0 | PC0 | PB7 | USB | RS232 | RS232 - USB | PB0